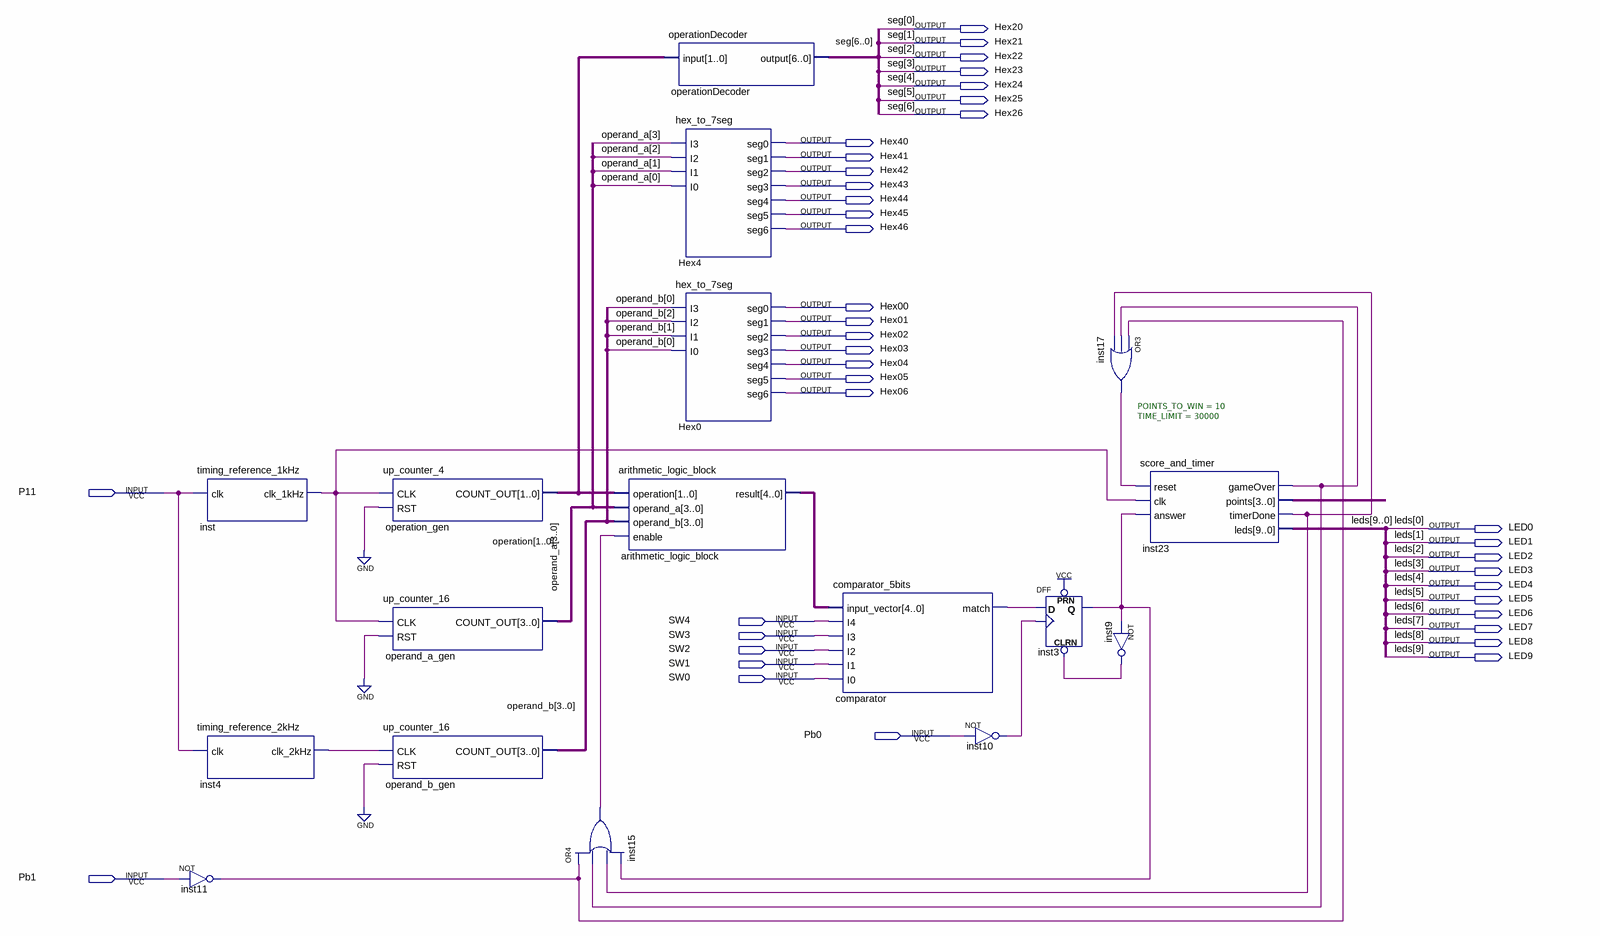
[diagram p0: schematic sheet]
// Quartus schematic math_and_logic_game.bdf as structural Verilog: 17 symbols, 39 pins
module math_and_logic_game (
  input  P11,
  input  SW4,
  input  SW3,
  input  SW2,
  input  SW1,
  input  SW0,
  input  Pb0,
  input  Pb1,
  output Hex20,
  output Hex21,
  output Hex22,
  output Hex23,
  output Hex24,
  output Hex25,
  output Hex26,
  output Hex40,
  output Hex41,
  output Hex42,
  output Hex43,
  output Hex44,
  output Hex45,
  output Hex46,
  output Hex00,
  output Hex01,
  output Hex02,
  output Hex03,
  output Hex04,
  output Hex05,
  output Hex06,
  output LED0,
  output LED1,
  output LED2,
  output LED3,
  output LED4,
  output LED5,
  output LED6,
  output LED7,
  output LED8,
  output LED9
);

  wire comparator_match, inst3_q, inst4_clk_2khz, inst9_out, inst10_out, inst11_out, inst15_out, inst17_out,
       inst23_gameover, inst23_timerdone, inst_clk_1khz;
  wire [1:0] operation;
  wire [3:0] inst23_points, operand_a, operand_b;
  wire [4:0] arithmetic_logic_block_result;

  timing_reference_1kHz inst (.clk(P11), .clk_1kHz(inst_clk_1khz));
  timing_reference_2kHz inst4 (.clk(P11), .clk_2kHz(inst4_clk_2khz));
  not inst11 (inst11_out, Pb1);
  up_counter_4 operation_gen (.CLK(inst_clk_1khz), .RST(1'b0), .COUNT_OUT(operation));
  up_counter_16 operand_a_gen (.CLK(inst_clk_1khz), .RST(1'b0), .COUNT_OUT(operand_a));
  up_counter_16 operand_b_gen (.CLK(inst4_clk_2khz), .RST(1'b0), .COUNT_OUT(operand_b));
  arithmetic_logic_block arithmetic_logic_block (
    .operation(operation), .operand_a(operand_a), .operand_b(operand_b), .enable(inst15_out),
    .result(arithmetic_logic_block_result));
  or inst15 (inst15_out, inst11_out, inst23_gameover, inst23_timerdone, inst3_q);
  operationDecoder operationDecoder (.\input (operation), .\output ({Hex26, Hex25, Hex24, Hex23, Hex22, Hex21, Hex20}));
  hex_to_7seg Hex4 (
    .I3(operand_a[3]), .I2(operand_a[2]), .I1(operand_a[1]), .I0(operand_a[0]), .seg0(Hex40), .seg1(Hex41),
    .seg2(Hex42), .seg3(Hex43), .seg4(Hex44), .seg5(Hex45), .seg6(Hex46));
  hex_to_7seg Hex0 (
    .I3(operand_b[0]), .I2(operand_b[2]), .I1(operand_b[1]), .I0(operand_b[0]), .seg0(Hex00), .seg1(Hex01),
    .seg2(Hex02), .seg3(Hex03), .seg4(Hex04), .seg5(Hex05), .seg6(Hex06));
  comparator_5bits comparator (
    .input_vector(arithmetic_logic_block_result), .I4(SW4), .I3(SW3), .I2(SW2), .I1(SW1), .I0(SW0),
    .match(comparator_match));
  not inst10 (inst10_out, Pb0);
  DFF inst3 (.CLRN(inst9_out), .CLK(inst10_out), .D(comparator_match), .PRN(1'b1), .Q(inst3_q));
  or inst17 (inst17_out, inst11_out, inst23_gameover, inst23_timerdone);
  not inst9 (inst9_out, inst3_q);
  score_and_timer #(.POINTS_TO_WIN(10), .TIME_LIMIT(30000)) inst23 (
    .reset(inst17_out), .clk(inst_clk_1khz), .answer(inst3_q), .gameOver(inst23_gameover),
    .points(inst23_points), .timerDone(inst23_timerdone),
    .leds({LED9, LED8, LED7, LED6, LED5, LED4, LED3, LED2, LED1, LED0}));

  // Other names for the same wires on the sheet: leds[9:0] = {LED9, LED8, LED7, LED6, LED5, LED4, LED3, LED2, LED1, LED0};
  //   seg[6:0] = {Hex26, Hex25, Hex24, Hex23, Hex22, Hex21, Hex20}
endmodule
